# Altium project ESP8266-Deskop_Power.PrjPcb (part 2 of 2)

## Sheet 8_Front_Pannel_Con.SchDoc: Front Pannel Con
size A4; ApprovedBy: Alcatraz; CheckedBy: Alcatraz; Author: Alcatraz; CompanyName: DHNLAB; DrawnBy: Alcatraz; Engineer: Alcatraz; Organization: DHNLAB PVT LTD; Address1: DHANBAD; Address2: JHARKHAND; Address3: INDIA; Address4: ASIA; DocumentNumber: 8; Revision: 1.0; SheetNumber: 8; SheetTotal: 10; ProjectTitle: ESP8266-Deskop_Power
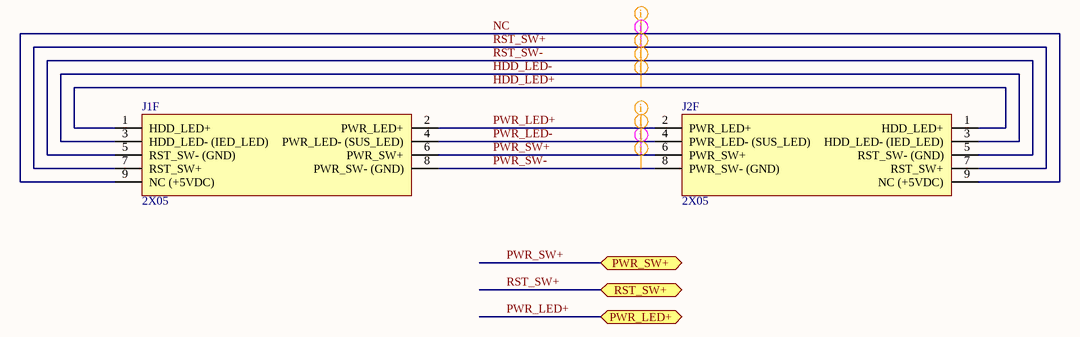
[diagram p7: 8_Front_Pannel_Con.SchDoc]

### Parts
J1F  2X05  [Front_Pannel_2x05_P2.54mm_Horizontal_Right]
J2F  2X05  [Front_Pannel_2x05_P2.54mm_Horizontal_Left]

### Ports
PWR_LED+ (bidir, see 3_ESP8266_Core[4B]), PWR_SW+ (bidir, see 3_ESP8266_Core[4B]), RST_SW+ (bidir, see 3_ESP8266_Core[4B])

### Nets
HDD_LED+: J1F.1(HDD_LED+) J2F.1(HDD_LED+)
HDD_LED-: J1F.3(HDD_LED-_(IED_LED)) J2F.3(HDD_LED-_(IED_LED))
NC: J1F.9(NC_(+5VDC)) J2F.9(NC_(+5VDC))
PWR_LED+: J1F.2(PWR_LED+) J2F.2(PWR_LED+) ; port PWR_LED+
PWR_LED-: J1F.4(PWR_LED-_(SUS_LED)) J2F.4(PWR_LED-_(SUS_LED))
PWR_SW+: J1F.6(PWR_SW+) J2F.6(PWR_SW+) ; port PWR_SW+
PWR_SW-: J1F.8(PWR_SW-_(GND)) J2F.8(PWR_SW-_(GND))
RST_SW+: J1F.7(RST_SW+) J2F.7(RST_SW+) ; port RST_SW+
RST_SW-: J1F.5(RST_SW-_(GND)) J2F.5(RST_SW-_(GND))

### Layout directives
net class Power; net class PowerRails_LowVoltage_DC; net class Power_Signal: HDD_LED+, HDD_LED-, NC, PWR_LED+, PWR_LED-, PWR_SW-, RST_SW-
net class Digital_Signal_Low_Speed; net class Signal_75_ohm: PWR_SW+, RST_SW+

### Notes on the sheet
- Title:
- Author:
- Approved:
- Size:
- Date:
- Git Hash:
- A4
- Prj:
- SW Version:
- Variant:
- Edited:
- PUBLIC
- File:

### Library data of the parts
J1F J2F = Front_Pannel_2x05_P2.54mm

## Sheet 9_Front_Pannel_USB_Con.SchDoc: Front Pannel USB Con
size A4; ApprovedBy: Alcatraz; CheckedBy: Alcatraz; Author: Alcatraz; CompanyName: DHNLAB; DrawnBy: Alcatraz; Engineer: Alcatraz; Organization: DHNLAB PVT LTD; Address1: DHANBAD; Address2: JHARKHAND; Address3: INDIA; Address4: ASIA; DocumentNumber: 9; Revision: 1.0; SheetNumber: 9; SheetTotal: 10; ProjectTitle: ESP8266-Deskop_Power
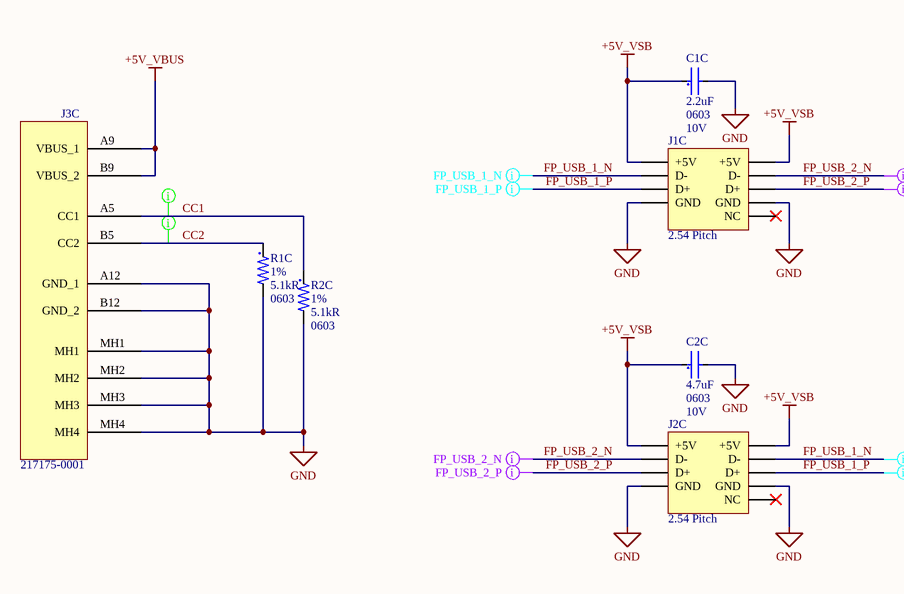
[diagram p8: 9_Front_Pannel_USB_Con.SchDoc]

### Parts
C1C  value 2.2uF  Case Code (Imperial): 0603  Voltage Rating: 10V  [C0603-IPC_C_No_Silk]  (hidden comment: C1608X7R1A225K080AC)
C2C  value 4.7uF  Case Code (Imperial): 0603  Voltage Rating: 10V  [C0603-IPC_C_No_Silk]  (hidden comment: CL10A475KP8NNNC)
J1C  2.54 Pitch  [USB_Front_Pannel_2x05_P2.54mm_Horizontal_Right]
J2C  2.54 Pitch  [USB_Front_Pannel_2x05_P2.54mm_Horizontal_Left]
J3C  217175-0001  [USB-Type-C-6-Pin-SMT]
R1C  value 5.1kR  Tolerance: 1%  Case/Package: 0603  [R0603-MFG]  (hidden comment: CRCW06035K10FKEA)
R2C  value 5.1kR  Tolerance: 1%  Case/Package: 0603  [R0603-MFG]  (hidden comment: CRCW06035K10FKEA)

### Nets
+5V_VBUS: J3C.A9(VBUS_1) J3C.B9(VBUS_2)
+5V_VSB: C1C.1 C2C.1 J1C.1(+5V) J1C.2(+5V) J2C.1(+5V) J2C.2(+5V)
GND: C1C.2 C2C.2 J1C.7(GND) J1C.8(GND) J2C.7(GND) J2C.8(GND) J3C.A12(GND_1) J3C.B12(GND_2) J3C.MH1 J3C.MH2 J3C.MH3 J3C.MH4 R1C.2 R2C.2
CC1: J3C.A5(CC1) R2C.1
CC2: J3C.B5(CC2) R1C.1
FP_USB_1_N: J1C.3(D-) J2C.4(D-)
FP_USB_1_P: J1C.5(D+) J2C.6(D+)
FP_USB_2_N: J1C.4(D-) J2C.3(D-)
FP_USB_2_P: J1C.6(D+) J2C.5(D+)

Not connected (* = marked no-connect by the designer): J1C 10(NC)*; J2C 10(NC)*

### Layout directives
net class Digital_Signal_Low_Speed; net class Signal: CC1, CC2
differential pair; differential pair class USB_DATA: FP_USB_1_N, FP_USB_1_P, FP_USB_2_N, FP_USB_2_P

### Notes on the sheet
- Title:
- Author:
- Approved:
- Size:
- Date:
- Git Hash:
- A4
- Prj:
- SW Version:
- Variant:
- Edited:
- PUBLIC
- File:

### Library data of the parts
C1C = 2.2uF_10V: Multilayer Ceramic Capacitor, 2.2 uF, 10 V, ± 10%, X7R, 0603 [1608 Metric]; Manufacturer: TDK; Material: 4241ConductorMaterial; Supplier 1: CoreStaff; Manufacturer Part Number: C1608X7R1A225K080AC; RoHS: Yes; Category: Ceramic Capacitors; Mounting Technology: Surface Mount; Case/Package: 0603; Case Code (Metric): 1608; Min Operating Temperature: -55°C; Max Operating Temperature: 125°C; Packaging: Tape and Reel; Tolerance: 10%; Series: C; Length: 1.6mm; Width: 0.8mm; RoHS Compliant: Yes; Supplier Part Number 1: ST60281773; Stock 1: 4000; Pricing 1: 1=48, 50=24.44, 100=15.65, 300=9.79, 500=8.62, 1000=7.74, 4000=7.08, 5000=7.04 (JPY); Package Quantity: 4000; Voltage Rating (DC): 10V; Dielectric: X7R; Construction: Flat; Height: 0.8mm; Depth: 0.8mm; Pins: 2NUMBER; Dielectric Material: Ceramic; Weight: 7.1E-05oz; Termination: SMD/SMT; Lead Free: Lead Free; Reach SVHC Compliant: No; ComponentLink1URL: https://datasheet.ciiva.com/24216/c1608x7r1a225k080ac-264808-24216485.pdf?src-supplier=Mouser; ComponentLink1Description: https://datasheet.ciiva.com/24216/c1608x7r1a225k080ac-264808-24216485.pdf?src-supplier=Mouser; ComponentLink2URL: https://datasheet.ciiva.com/22718/1796654-22718012.pdf?src-supplier=Element14; ComponentLink2Description: https://datasheet.ciiva.com/22718/1796654-22718012.pdf?src-supplier=Element14; ComponentLink3URL: https://datasheet.ciiva.com/28451/1796654-28451240.pdf?src-supplier=Element14; ComponentLink3Description: https://datasheet.ciiva.com/28451/1796654-28451240.pdf?src-supplier=Element14; ComponentLink4URL: https://datasheet.ciiva.com/6290/tdkmlcccaprange-6290824.pdf?src-supplier=Digikey; ComponentLink4Description: https://datasheet.ciiva.com/6290/tdkmlcccaprange-6290824.pdf?src-supplier=Digikey; ComponentLink5URL: https://datasheet.ciiva.com/23802/1796654-23802775.pdf?src-supplier=Newark; ComponentLink5Description: https://datasheet.ciiva.com/23802/1796654-23802775.pdf?src-supplier=Newark; ComponentLink6URL: https://datasheet.ciiva.com/22725/1913358-22725529.pdf?src-supplier=Element14; ComponentLink6Description: https://datasheet.ciiva.com/22725/1913358-22725529.pdf?src-supplier=Element14; ComponentLink7URL: https://datasheet.ciiva.com/6290/tdkmlcccaprange-6290821.pdf?src-supplier=Digikey; ComponentLink7Description: https://datasheet.ciiva.com/6290/tdkmlcccaprange-6290821.pdf?src-supplier=Digikey
C2C = 4.7uF_10V: Multilayer Ceramic Capacitor, 4.7 uF, 10 V, ± 10%, X5R, 0603 [1608 Metric]; Manufacturer: Samsung; Supplier 1: Verical; Manufacturer Part Number: CL10A475KP8NNNC; RoHS: Yes; Category: Ceramic Capacitors; Mounting Technology: Surface Mount; Case/Package: 0603; Case Code (Metric): 1608; Min Operating Temperature: -55°C; Max Operating Temperature: 85°C; Packaging: Tape and Reel; Tolerance: 10%; Series: CL; Length: 1.6mm; Width: 0.031inch; RoHS Compliant: Yes; Supplier Part Number 1: CL10A475KP8NNNC; Stock 1: 412000; Pricing 1: 4000=0.0042 (USD); Package Quantity: 1; Voltage Rating (DC): 10V; Dielectric: X5R; Construction: Flat; Height: 0.8mm; Depth: 0.8mm; Thickness: 0.035inch; Radiation Hardening: No
J1C J2C = USB_Front_Pannel_2x05_P2.54mm
J3C = USB-Type-C-6-Pin-SMT: Connector USB Type C Female 6Positions 0.5mm Right Angle SMT Embossed T/R - Tape and Reel; Manufacturer_Name: Molex; Geometry.Height: 3.46mm; Mouser Part Number: 538-217175-0001; Mouser Price/Stock: https://www.mouser.co.uk/ProductDetail/Molex/217175-0001?qs=DRkmTr78QARWJMiqNnldSg%3D%3D; Manufacturer_Part_Number: 217175-0001; Datasheet Link: https://www.molex.com/pdm_docs/sd/2171750001_sd.pdf
R1C R2C = 5.1K: SMD Chip Resistor, 5.1 kOhm, ± 1%, 100 mW, 0603 [1608 Metric], Thick Film, General Purpose; Manufacturer: Vishay; Temperature Coefficient: 100ppm/°C; Max Power Dissipation: 100mW; Voltage Rating: 75V; Supplier 1: Mouser; Manufacturer Part Number: CRCW06035K10FKEA; RoHS: Yes; Category: Chip SMD Resistors; Stock 1: 43654; Pricing 1: 1=0.1, 10=0.034, 50=0.034, 100=0.014, 1000=0.008, 10000=0.004 (USD); Case Code (Imperial): 0603; Case Code (Metric): 1608; Min Operating Temperature: -55°C; Max Operating Temperature: 155°C; Packaging: Tape and Reel; Series: CRCW; Number of Terminations: 2; Voltage Rating (DC): 75V; Package Quantity: 5000; Length: 1.55mm; Width: 0.85mm; Height: 0.45mm; RoHS Compliant: Yes; ComponentLink1URL: https://datasheet.ciiva.com/11809/0900766b80d98afc-11809935.pdf?src-supplier=Rs; ComponentLink1Description: https://datasheet.ciiva.com/11809/0900766b80d98afc-11809935.pdf?src-supplier=Rs; ComponentLink2URL: https://datasheet.ciiva.com/7690/1720486-7690873.pdf?src-supplier=Element14; ComponentLink2Description: https://datasheet.ciiva.com/7690/1720486-7690873.pdf?src-supplier=Element14; ComponentLink3URL: https://datasheet.ciiva.com/15159/getdatasheetpartid-32793-15159338.pdf?src-supplier=Verical; ComponentLink3Description: https://datasheet.ciiva.com/15159/getdatasheetpartid-32793-15159338.pdf?src-supplier=Verical; Supplier Part Number 1: 71-CRCW0603-5.1K-E3; Weight: 7.1E-05oz; Contact Plating: Tin; Features: Automotive AEC-Q200; Power Rating: 100mW; Termination: SMD/SMT; Resistor Type: Thick Film; Construction: Rectangular; Resistance Tolerance: 1%; Technology: THICK FILM; Depth: 0.85mm; Radiation Hardening: No; Lead Free: 5697LeadFree; Military Standard: Not; Reach SVHC Compliant: Unknown; ComponentLink4URL: https://datasheet.ciiva.com/26314/fld-crcw-e3-data-en-26314742.pdf?src-supplier=Distrelec; ComponentLink4Description: https://datasheet.ciiva.com/26314/fld-crcw-e3-data-en-26314742.pdf?src-supplier=Distrelec; ComponentLink5URL: https://datasheet.ciiva.com/7690/1697337-7690728.pdf?src-supplier=Element14; ComponentLink5Description: https://datasheet.ciiva.com/7690/1697337-7690728.pdf?src-supplier=Element14; ComponentLink6URL: https://datasheet.ciiva.com/3257/dcrcwe3-3257758.pdf?src-supplier=Avnet; ComponentLink6Description: https://datasheet.ciiva.com/3257/dcrcwe3-3257758.pdf?src-supplier=Avnet; ComponentLink7URL: https://datasheet.ciiva.com/16226/dcrcwe3-16226862.pdf?src-supplier=Future+Electronics; ComponentLink7Description: https://datasheet.ciiva.com/16226/dcrcwe3-16226862.pdf?src-supplier=Future+Electronics

## Sheet 10_MountingHoles.SchDoc: MountingHoles
size A4; ApprovedBy: Alcatraz; CheckedBy: Alcatraz; Author: Alcatraz; CompanyName: DHNLAB; DrawnBy: Alcatraz; Engineer: Alcatraz; Organization: DHNLAB PVT LTD; Address1: DHANBAD; Address2: JHARKHAND; Address3: INDIA; Address4: ASIA; DocumentNumber: 10; Revision: 1.0; SheetNumber: 10; SheetTotal: 10; ProjectTitle: ESP8266-Deskop_Power
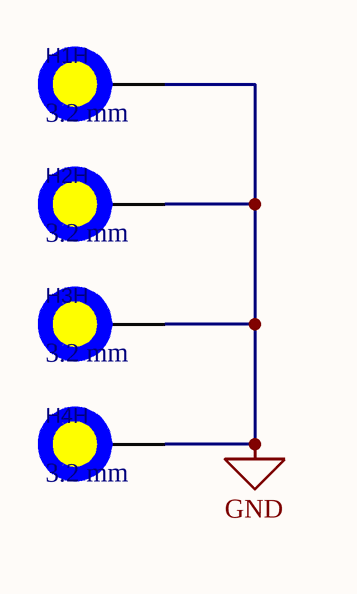
[diagram p9: 10_MountingHoles.SchDoc]

### Parts
H1H  3.2 mm  [MountingHole_3.2mm_M3_Pad_Via_Mask]
H2H  3.2 mm  [MountingHole_3.2mm_M3_Pad_Via_Mask]
H3H  3.2 mm  [MountingHole_3.2mm_M3_Pad_Via_Mask]
H4H  3.2 mm  [MountingHole_3.2mm_M3_Pad_Via_Mask]

### Nets
GND: H1H.1 H2H.1 H3H.1 H4H.1

### Notes on the sheet
- Title:
- Author:
- Approved:
- Size:
- Date:
- Git Hash:
- A4
- Prj:
- SW Version:
- Variant:
- Edited:
- PUBLIC
- File:

### Library data of the parts
H1H H2H H3H H4H = MountingHole_Pad_3.2mm: ki_description: Mounting Hole with connection; ki_fp_filters: MountingHole*Pad*; Supplier: ~; ki_keywords: mounting hole; Value: 3.2 mm

## Nets that join several sheets
+3VALW: 2_LDO (6 pins), 3_ESP8266_Core (6 pins), 4_UART (J1U.6), 6_I2C_Sensors (6 pins)
+5V_VBUS: 1_Power_Path (Q2P.1-2-5-6-7), 9_Front_Pannel_USB_Con (J3C.A9 J3C.B9)
+5V_VSB: 1_Power_Path (Q1P.1-2-5-6-7), 9_Front_Pannel_USB_Con (6 pins)
+5VALW: 1_Power_Path (F1P.2), 2_LDO (5 pins), 5_Keys_And_Status (LED1K.1)
GND: 1_Power_Path (R1P.2), 2_LDO (9 pins), 3_ESP8266_Core (C1E.2 C2E.2 IC1E.15 R5E.2), 4_UART (J1U.1), 5_Keys_And_Status (LED1K.3 SW1K.1 SW2K.2), 6_I2C_Sensors (J1I.1 J1I.2 J2I.1), 7_Mosfets (7 pins), 9_Front_Pannel_USB_Con (14 pins), 10_MountingHoles (H1H.1 H2H.1 H3H.1 H4H.1)
EN/RST/nRST: 3_ESP8266_Core (C1E.1 IC1E.1 R4E.2), 4_UART (J1U.5), 5_Keys_And_Status (R1K.1)
ESP_I2C_0_N: 3_ESP8266_Core (IC1E.19), 6_I2C_Sensors (J1I.5 J1I.8 R2I.2)
ESP_I2C_0_P: 3_ESP8266_Core (IC1E.20), 6_I2C_Sensors (J1I.6 J1I.7 R1I.2)
ESP_UART_0_N: 3_ESP8266_Core (IC1E.21), 4_UART (J1U.2)
ESP_UART_0_P: 3_ESP8266_Core (IC1E.22), 4_UART (J1U.3)
GPIO2(D4): 3_ESP8266_Core (IC1E.17 R3E.2), 5_Keys_And_Status (R3K.2)
GPIO12(D6): 3_ESP8266_Core (IC1E.6), 7_Mosfets (R3M.2)
GPIO13(D7): 3_ESP8266_Core (IC1E.7), 7_Mosfets (Q3M.3 R4M.1)
GPIO14(D5): 3_ESP8266_Core (IC1E.5), 7_Mosfets (R2M.2)
GPIO15(D8): 3_ESP8266_Core (IC1E.16 R5E.1), 7_Mosfets (R8M.2)
GPIO16(D0): 3_ESP8266_Core (IC1E.4), 6_I2C_Sensors (J2I.2 R3I.2)
IO0/GPIO0: 3_ESP8266_Core (IC1E.18 R2E.2), 4_UART (J1U.4), 5_Keys_And_Status (R4K.1)
PWR_LED+: 7_Mosfets (Q3M.2 R1M.2 R4M.2), 8_Front_Pannel_Con (J1F.2 J2F.2)
PWR_SW+: 7_Mosfets (Q1M.3), 8_Front_Pannel_Con (J1F.6 J2F.6)
Relay_EXT_GND: 6_I2C_Sensors (J2I.4), 7_Mosfets (Q4M.3)
RST_SW+: 7_Mosfets (Q2M.3), 8_Front_Pannel_Con (J1F.7 J2F.7)